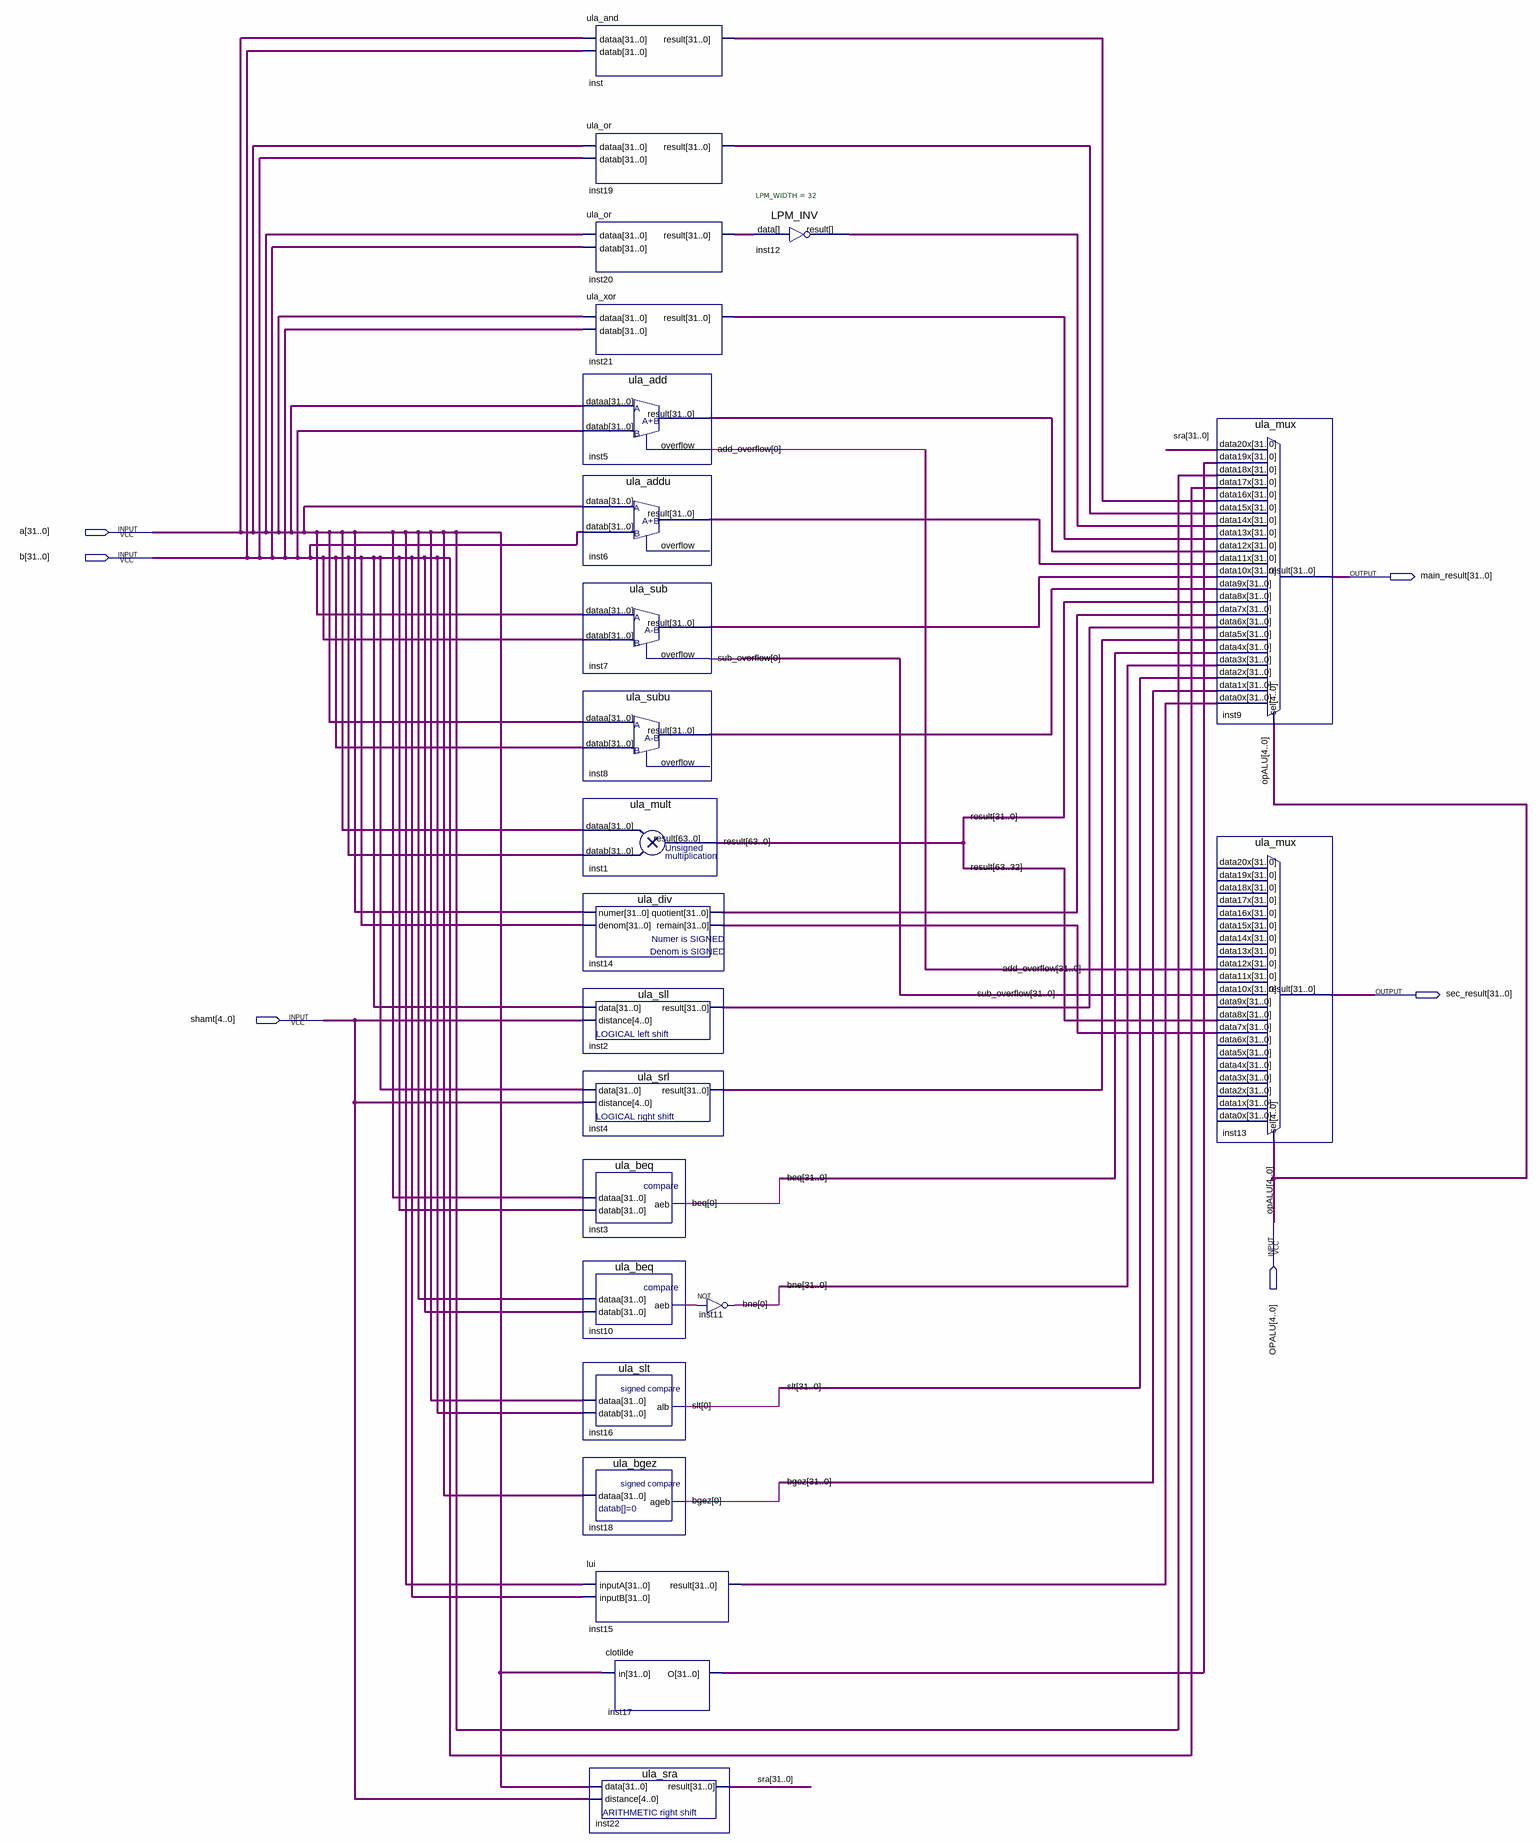
[diagram p0: schematic sheet]
// Quartus schematic agoravai.bdf as structural Verilog: 23 symbols, 6 pins
module agoravai (
  input  [31:0] a,
  input  [31:0] b,
  input  [4:0] shamt,
  input  [4:0] OPALU,
  output [31:0] main_result,
  output [31:0] sec_result
);

  wire inst10_aeb;
  wire [31:0] add_overflow, beq, bgez, bne, inst2_result, inst4_result, inst5_result, inst6_result,
       inst7_result, inst8_result, inst12_result, inst14_quotient, inst14_remain, inst15_result, inst17_o,
       inst19_result, inst20_result, inst21_result, inst_result, slt, sra, sub_overflow;
  wire [63:0] result;

  ula_and inst (.dataa(a), .datab(b), .result(inst_result));
  ula_or inst19 (.dataa(a), .datab(b), .result(inst19_result));
  ula_or inst20 (.dataa(a), .datab(b), .result(inst20_result));
  ula_xor inst21 (.dataa(a), .datab(b), .result(inst21_result));
  ula_add inst5 (.dataa(a), .datab(b), .result(inst5_result), .overflow(add_overflow[0]));
  ula_addu inst6 (.dataa(a), .datab(b), .result(inst6_result));  // open: overflow
  ula_sub inst7 (.dataa(a), .datab(b), .result(inst7_result), .overflow(sub_overflow[0]));
  ula_subu inst8 (.dataa(a), .datab(b), .result(inst8_result));  // open: overflow
  ula_mult inst1 (.dataa(a), .datab(b), .result(result));
  ula_div inst14 (.numer(a), .denom(b), .quotient(inst14_quotient), .remain(inst14_remain));
  ula_sll inst2 (.data(b), .distance(shamt), .result(inst2_result));
  ula_srl inst4 (.data(b), .distance(shamt), .result(inst4_result));
  ula_beq inst3 (.dataa(a), .datab(b), .aeb(beq[0]));
  ula_beq inst10 (.dataa(a), .datab(b), .aeb(inst10_aeb));
  ula_slt inst16 (.dataa(a), .datab(b), .alb(slt[0]));
  ula_bgez inst18 (.dataa(a), .ageb(bgez[0]));
  lui inst15 (.inputA(a), .inputB(b), .result(inst15_result));
  clotilde inst17 (.in(a), .O(inst17_o));
  ula_sra inst22 (.data(a), .distance(shamt), .result(sra));
  not inst11 (bne[0], inst10_aeb);
  LPM_INV #(.LPM_WIDTH(32)) inst12 (.data(inst20_result), .result(inst12_result));
  ula_mux inst9 (
    .data20x(sra), .data19x(inst17_o), .data18x(a), .data17x(b), .data16x(inst_result),
    .data15x(inst19_result), .data14x(inst12_result), .data13x(inst21_result), .data12x(inst5_result),
    .data11x(inst6_result), .data10x(inst7_result), .data9x(inst8_result), .data8x(result[31:0]),
    .data7x(inst14_quotient), .data6x(inst2_result), .data5x(inst4_result), .data4x(beq), .data3x(bne),
    .data2x(slt), .data1x(bgez), .data0x(inst15_result), .sel(OPALU), .result(main_result));
  ula_mux inst13 (
    .data12x(add_overflow), .data10x(sub_overflow), .data8x(result[63:32]), .data7x(inst14_remain),
    .sel(OPALU), .result(sec_result));  // open: data20x, data19x, data18x, data17x, data16x, data15x, data14x, data13x, data11x, data9x, data6x, data5x, data4x, data3x, data2x, data1x, data0x
endmodule
